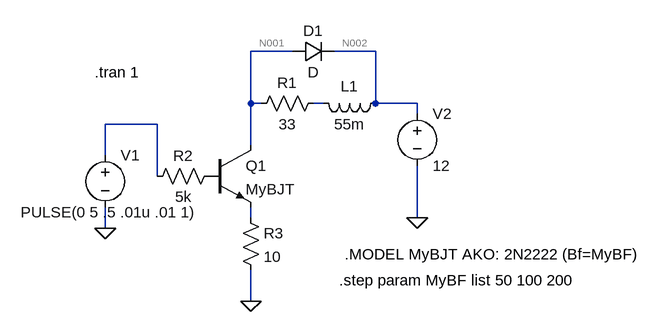
[diagram p0: schematic bjt.asc]
bjt.asc, the LTspice schematic file:
Version 4
SHEET 1 880 680
WIRE 192 48 128 48
WIRE 320 48 256 48
WIRE 128 128 128 48
WIRE 144 128 128 128
WIRE 240 128 224 128
WIRE 320 128 320 48
WIRE 384 128 320 128
WIRE 384 144 384 128
WIRE -16 160 -96 160
WIRE 128 192 128 128
WIRE -96 208 -96 160
WIRE -16 240 -16 160
WIRE 128 304 128 288
WIRE 384 304 384 224
WIRE -96 320 -96 288
WIRE 128 432 128 384
FLAG 384 304 0
FLAG -96 320 0
FLAG 128 432 0
SYMBOL ind 336 112 R90
WINDOW 0 5 56 VBottom 2
WINDOW 3 32 56 VTop 2
SYMATTR InstName L1
SYMATTR Value 55m
SYMBOL diode 192 64 R270
WINDOW 0 32 32 VTop 2
WINDOW 3 0 32 VBottom 2
SYMATTR InstName D1
SYMBOL voltage -96 192 R0
WINDOW 123 0 0 Left 0
WINDOW 39 0 0 Left 0
WINDOW 3 -130 103 Left 2
SYMATTR InstName V1
SYMATTR Value PULSE(0 5 .5 .01u .01 1)
SYMBOL voltage 384 128 R0
WINDOW 123 0 0 Left 0
WINDOW 39 0 0 Left 0
SYMATTR InstName V2
SYMATTR Value 12
SYMBOL npn 64 192 R0
SYMATTR InstName Q1
SYMATTR Value MyBJT
SYMBOL res -32 256 R270
WINDOW 0 32 56 VTop 2
WINDOW 3 0 56 VBottom 2
SYMATTR InstName R2
SYMATTR Value 5k
SYMBOL res 240 112 R90
WINDOW 0 0 56 VBottom 2
WINDOW 3 32 56 VTop 2
SYMATTR InstName R1
SYMATTR Value 33
SYMBOL res 112 288 R0
SYMATTR InstName R3
SYMATTR Value 10
TEXT -112 80 Left 2 !.tran 1
TEXT 264 400 Left 2 !.step param MyBF list 50 100 200
TEXT 272 360 Left 2 !.MODEL MyBJT AKO: 2N2222 (Bf=MyBF)

The netlist it stands for:
* bjt.asc
L1 N002 N003 55m
D1 N001 N002 D
V1 N004 0 PULSE(0 5 .5 .01u .01 1)
V2 N002 0 12
Q1 N001 P001 N005 0 MyBJT
R2 N004 P001 5k
R1 N003 N001 33
R3 N005 0 10
.model D D
.lib standard.dio
.model NPN NPN
.model PNP PNP
.lib standard.bjt
.tran 1
.step param MyBF list 50 100 200
.MODEL MyBJT AKO: 2N2222 (Bf=MyBF)
.backanno
.end

* Results of the author's LTspice run, read from the files saved beside the schematic
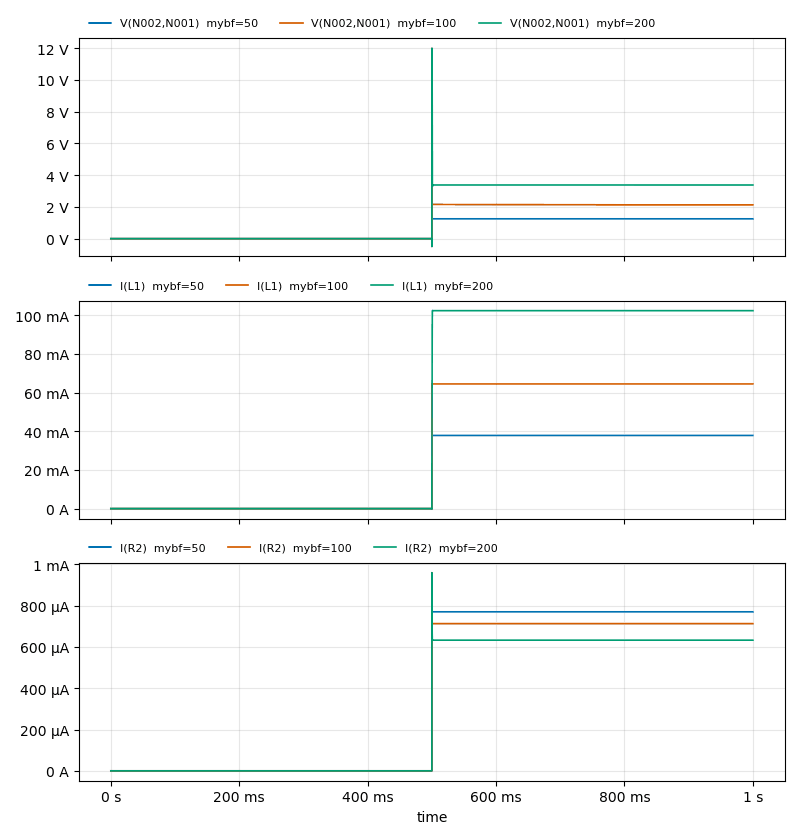
[diagram p1: Transient Analysis of bjt.asc, plotted from the saved traces]
* Transient Analysis, 3 runs:
*   V(N002,N001) [mybf=50]: min -489.3 mV, max 11.98 V, average 626.2 mV, rms 896 mV, last 1.248 V
*   V(N002,N001) [mybf=100]: min -489.4 mV, max 11.98 V, average 1.071 V, rms 1.523 V, last 2.128 V
*   V(N002,N001) [mybf=200]: min -489.5 mV, max 11.98 V, average 1.694 V, rms 2.402 V, last 3.378 V
*   I(L1) [mybf=50]: min -139.7 nA, max 37.83 mA, average 18.91 mA, rms 26.75 mA, last 37.83 mA
*   I(L1) [mybf=100]: min -139.7 nA, max 64.55 mA, average 32.22 mA, rms 45.58 mA, last 64.47 mA
*   I(L1) [mybf=200]: min -139.6 nA, max 102.4 mA, average 51.15 mA, rms 72.35 mA, last 102.4 mA
*   I(R2) [mybf=50]: min 0 A, max 959 µA, average 384.9 µA, rms 544.3 µA, last 769.8 µA
*   I(R2) [mybf=100]: min 0 A, max 959 µA, average 356.3 µA, rms 503.9 µA, last 712.5 µA
*   I(R2) [mybf=200]: min 0 A, max 959 µA, average 316.4 µA, rms 447.4 µA, last 632.6 µA